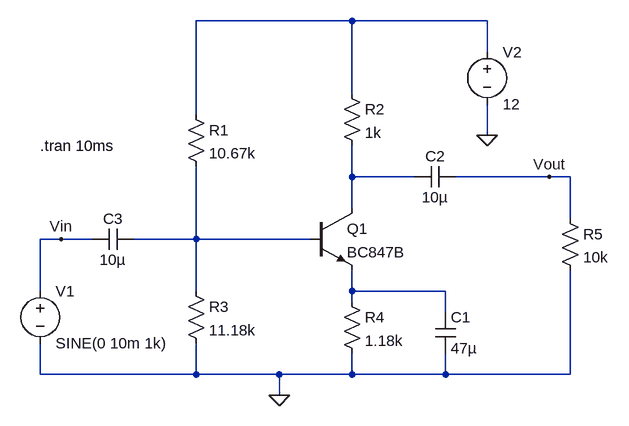
[diagram p0: schematic Ex-9.asc]
Ex-9.asc, the LTspice schematic file:
Version 4
SHEET 1 880 680
WIRE 208 -176 -32 -176
WIRE 416 -176 208 -176
WIRE 416 -128 416 -176
WIRE 208 -64 208 -176
WIRE -32 -32 -32 -176
WIRE 416 0 416 -48
WIRE 208 64 208 16
WIRE 304 64 208 64
WIRE 512 64 368 64
WIRE 544 64 512 64
WIRE 208 112 208 64
WIRE 544 128 544 64
WIRE -240 160 -272 160
WIRE -192 160 -240 160
WIRE -32 160 -32 48
WIRE -32 160 -128 160
WIRE 144 160 -32 160
WIRE -272 240 -272 160
WIRE -32 240 -32 160
WIRE 208 240 208 208
WIRE 352 240 208 240
WIRE 208 256 208 240
WIRE 352 272 352 240
WIRE -272 368 -272 320
WIRE -32 368 -32 320
WIRE -32 368 -272 368
WIRE 96 368 -32 368
WIRE 208 368 208 336
WIRE 208 368 96 368
WIRE 352 368 352 336
WIRE 352 368 208 368
WIRE 544 368 544 208
WIRE 544 368 352 368
WIRE 96 400 96 368
FLAG 96 400 0
FLAG 416 0 0
FLAG -240 160 Vin
FLAG 512 64 Vout
SYMBOL res -48 -48 R0
SYMATTR InstName R1
SYMATTR Value 10.67k
SYMBOL res 192 -80 R0
SYMATTR InstName R2
SYMATTR Value 1k
SYMBOL res -48 224 R0
SYMATTR InstName R3
SYMATTR Value 11.18k
SYMBOL res 192 240 R0
SYMATTR InstName R4
SYMATTR Value 1.18k
SYMBOL npn 144 112 R0
SYMATTR InstName Q1
SYMATTR Value BC847B
SYMBOL cap 336 272 R0
SYMATTR InstName C1
SYMATTR Value 47µ
SYMBOL cap 368 48 R90
WINDOW 0 0 32 VBottom 2
WINDOW 3 32 32 VTop 2
SYMATTR InstName C2
SYMATTR Value 10µ
SYMBOL res 528 112 R0
SYMATTR InstName R5
SYMATTR Value 10k
SYMBOL voltage -272 224 R0
WINDOW 123 0 0 Left 0
WINDOW 39 0 0 Left 0
SYMATTR InstName V1
SYMATTR Value SINE(0 10m 1k)
SYMBOL cap -128 144 R90
WINDOW 0 0 32 VBottom 2
WINDOW 3 32 32 VTop 2
SYMATTR InstName C3
SYMATTR Value 10µ
SYMBOL voltage 416 -144 R0
WINDOW 123 0 0 Left 0
WINDOW 39 0 0 Left 0
SYMATTR InstName V2
SYMATTR Value 12
TEXT -272 16 Left 2 !.tran 10ms

The netlist it stands for:
* Ex-9.asc
R1 N001 N003 10.67k
R2 N001 N002 1k
R3 N003 0 11.18k
R4 N004 0 1.18k
Q1 N002 N003 N004 0 BC847B
C1 N004 0 47µ
C2 Vout N002 10µ
R5 Vout 0 10k
V1 Vin 0 SINE(0 10m 1k)
C3 N003 Vin 10µ
V2 N001 0 12
.model NPN NPN
.model PNP PNP
.lib standard.bjt
.tran 10ms
.backanno
.end